# Altium project sensor.PrjPcb
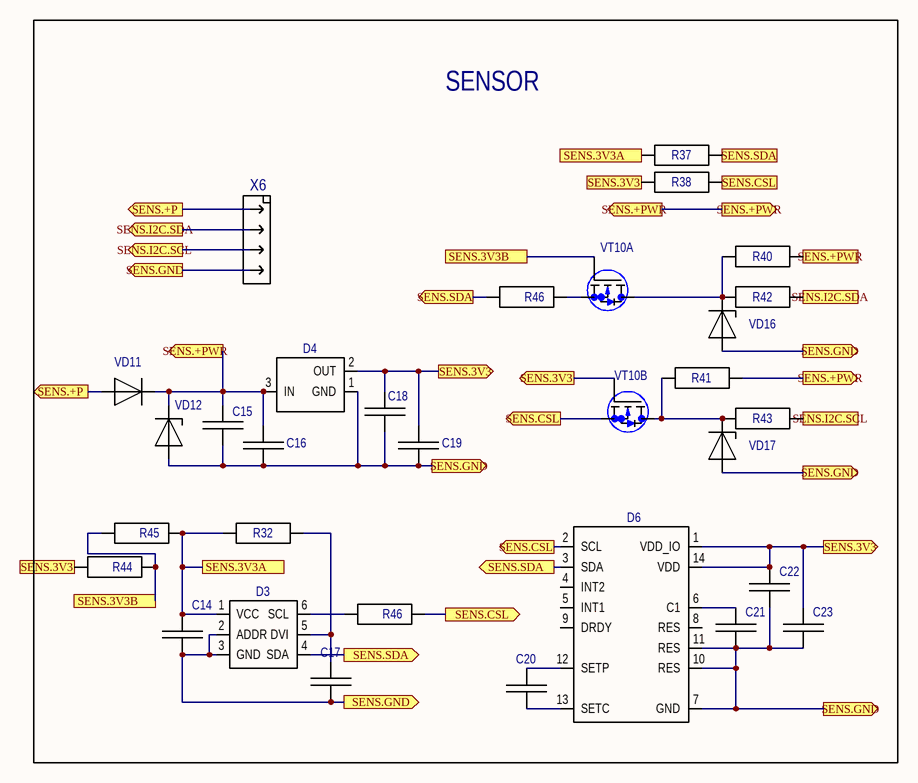
[diagram p0: SENSOR.SCHDOC]
1 sheet, 30 parts. Net scope: flat (ports and power ports of the same name join across sheets).
Board files: SENSOR.PcbDoc, panel.PcbDoc

## Sheet SENSOR.SCHDOC
size 1188 x 840 mm; SheetNumber: 1; SheetTotal: 1; DocumentName: Sheet1.SCHDOC

### Parts
(Parts that share a designator on the sheet are numbered #1, #2 ... from top to bottom, then left to right.)
C14  100n  [RC0805_THRU_C]  (value not drawn)
C15  10u  [1210T]  (value not drawn)
C16  100n  [RC0805_THRU_C]  (value not drawn)
C17  220n  [RC0805_THRU_C]  (value not drawn)
C18  10u  [RC0805_THRU_C]  (value not drawn)
C19  100n  [RC0805_THRU_C]  (value not drawn)
C20  220n  [RC0805_THRU_C]  (value not drawn)
C21  4u7  [RC0805_THRU_C]  (value not drawn)
C22  10u  [RC0805_THRU_C]  (value not drawn)
C23  100n  [RC0805_THRU_C]  (value not drawn)
D3  BH1750FVI  (value not drawn)
D4  LD1117  [SOT223]  (value not drawn)
D6  LSM303  (value not drawn)
R32  10K  [RC0805_THRU]  (value not drawn)
R37  2K2  [RC0805_THRU]  (value not drawn)
R38  2K2  [RC0805_THRU]  (value not drawn)
R40  10K  [RC0805_THRU]  (value not drawn)
R41  10K  [RC0805_THRU]  (value not drawn)
R42  10R  [RC0805_THRU]  (value not drawn)
R43  10R  [RC0805_THRU]  (value not drawn)
R44  0R  [RC0805_THRU]  (value not drawn)
R45  0R  [RC0805_THRU]  (value not drawn)
R46#1  0R  [RC0805_THRU]  (value not drawn)
R46#2  0R  [RC0805_THRU]  (value not drawn)
VD11  LL4148  [SMD4148]  (value not drawn)
VD12  BZV55  [SMD4148]  (value not drawn)
VD16  BZV55  [SMD4148]  (value not drawn)
VD17  BZV55  [SMD4148]  (value not drawn)
VT10  NTZD3155C  [SOT-363]  (value not drawn)  (parts A,B of 2)
X6  JMP4  [CONN_SENSOR]  (value not drawn)

### Blocks framed on the sheet
SENSOR: C14-C23 D3 D4 D6 R32 R37 R38 R40-R45 R46#1 R46#2 VD11 VD12 VD16 VD17 VT10 X6

### Ports
SENS.3V3 (out), SENS.3V3A, SENS.3V3B, SENS.+P (out), SENS.+PWR (out), SENS.CSL (out), SENS.GND (out), SENS.I2C.SCL (out), SENS.I2C.SDA (out), SENS.SDA (out)

### Nets
NetC14_1: C14.1 C15.1 C16.1 C17.1 C18.2 C19.1 C21.1 C22.1 C23.1 D3.2(ADDR) D3.3(GND) D4.1(GND) D6.7(GND) D6.10(RES) D6.11(RES) VD12.1 VD16.1 VD17.1 X6.4 ; port SENS.GND
NetC14_2: C14.2 D3.1(VCC) R32.1 R37.1 R45.2 ; port SENS.3V3A
NetC15_2: C15.2 C16.2 D4.3(IN) R40.2 R41.2 VD11.2 VD12.2 ; port SENS.+PWR
NetC17_2: C17.2 D3.5(DVI) R32.2
NetC18_1: C18.1 C19.2 C22.2 C23.2 D4.2(OUT) D6.1(VDD_IO) D6.14(VDD) R38.1 R44.1 VT10.5 ; port SENS.3V3
NetC20_1: C20.1 D6.13(SETC)
NetC20_2: C20.2 D6.12(SETP)
NetC21_2: C21.2 D6.6(C1)
NetD3_4: D3.4(SDA) D6.3(SDA) R37.2 R46#1.1 ; port SENS.SDA
NetD3_6: D3.6(SCL) R46#2.1
NetD6_2: D6.2(SCL) R38.2 R46#2.2 VT10.4 ; port SENS.CSL
NetR40_1: R40.1 R42.1 VD16.2 VT10.6
NetR41_1: R41.1 R43.1 VD17.2 VT10.3
NetR42_2: R42.2 X6.2 ; port SENS.I2C.SDA
NetR43_2: R43.2 X6.3 ; port SENS.I2C.SCL
NetR44_2: R44.2 R45.1 VT10.2 ; port SENS.3V3B
NetR46#1_2: R46#1.2 VT10.1
NetVD11_1: VD11.1 X6.1 ; port SENS.+P

Not connected (* = marked no-connect by the designer): D6 4(INT2) 5(INT1) 8(RES) 9(DRDY)

### Notes on the sheet
- {Децим_номер_инв}
- Перв. примен.
- {Перв_примен}
- Справ. №
- Подп. и дата
- Инв. № дубл.
- Взам. инв. №
- {Децим_номер}
- Изм.
- Разраб.
- Лист
- № докум.
- Подп.
- Дата
- {Название(сокр)}
- {Название}
- {Литера}
- Лит.
- Масса
- Масштаб
- Пров.
- Т. контр.
- {Пров}
- {Разраб}
- {Тконтр}
- Схема электрическая принципиальная
- Листов
- Инв. № подл.
- Утв.
- Н. контр.
- {Нконтр}
- {Утв}
- Формат А4

### Library data of the parts
C14 C16 C19 C23 = C0805THRU: Value: GRM21BR71H104KA01; Title: Конденсатор; Exec: C; Price: 000000,55; val: 100n
C15 = CC1210: Value: GRM32DR71E106KA12L; Title: Конденсатор; Exec: {Exec}; Price: 000003,00; val: 10u
C17 C20 = C0805THRU: Value: GRM21BR71H224KA01; Title: Конденсатор; Exec: {Exec}; Price: 000000,55; val: 220n
C18 = C0805THRU_VARIANT_2: Value: GRM219R61E106KA12D; Title: Конденсатор; Price: 000002,00; val: 10u
C21 = C0805THRU: Value: GRM219R61E475KA12D; Title: Конденсатор; Exec: {Exec}; Price: 000000,55; val: 4u7
C22 = C0805THRU: Value: GRM219R61E106KA12D; Title: Конденсатор; Exec: C; Price: 000002,00; val: 10u
D3 = BH1750FVI: Exec: {Exec}; Value: BH1750FVI; Price: 000045,00; val: *
D4 = LD1117: Value: LD1117S33TR; Exec: {Exec}; Price: 000005,00; val: *
D6 = LSM303: Value: LSM303DLHC; Exec: {Exec}; Price: 000095,00; val: *
R32 R40 R41 = R0805THRU: Value: 0805WAJ0103T10; Note: ROYALOHM; Exec: {Exec}; Price: 000000,05; val: 10K
R37 R38 = R0805THRU: Value: 0805WAJ0222T10; Note: ROYALOHM; Exec: {Exec}; Price: 000000,05; val: 2K2
R42 R43 = R0805THRU: Value: 0805WAJ0100T10; Note: ROYALOHM; Exec: {Exec}; Price: 000000,05; val: 10R
R44 R45 R46#1 R46#2 = R0805THRU: Value: 0805WAJ0000T10; Note: ROYALOHM; Exec: {Exec}; Price: 000000,05
  R44 R45 R46#2: val: 0R
  R46#1: val: *
VD11 = LL4148: Value: LL4148-GS08; Exec: {Exec}; Price: 000000,40; val: *
VD12 = BZV55: Value: BZV55-C18.115; Title: Стабилитрон; Exec: {Exec}; Price: 000001,00; val: *
VD16 VD17 = BZV55: Value: BZV55-C18.115; Title: Стабилитрон; Note: {Note}; Exec: {Exec}; Price: 000001,00; val: *
VT10 = NTZD3155C: Value: NTJD5121NT1G; Price: 000005,00; val: *
X6 = CONN_SENSOR: Value: *; val: *